# Altium schematic sheet Connectors_GPIOs_old.SchDoc
size A3
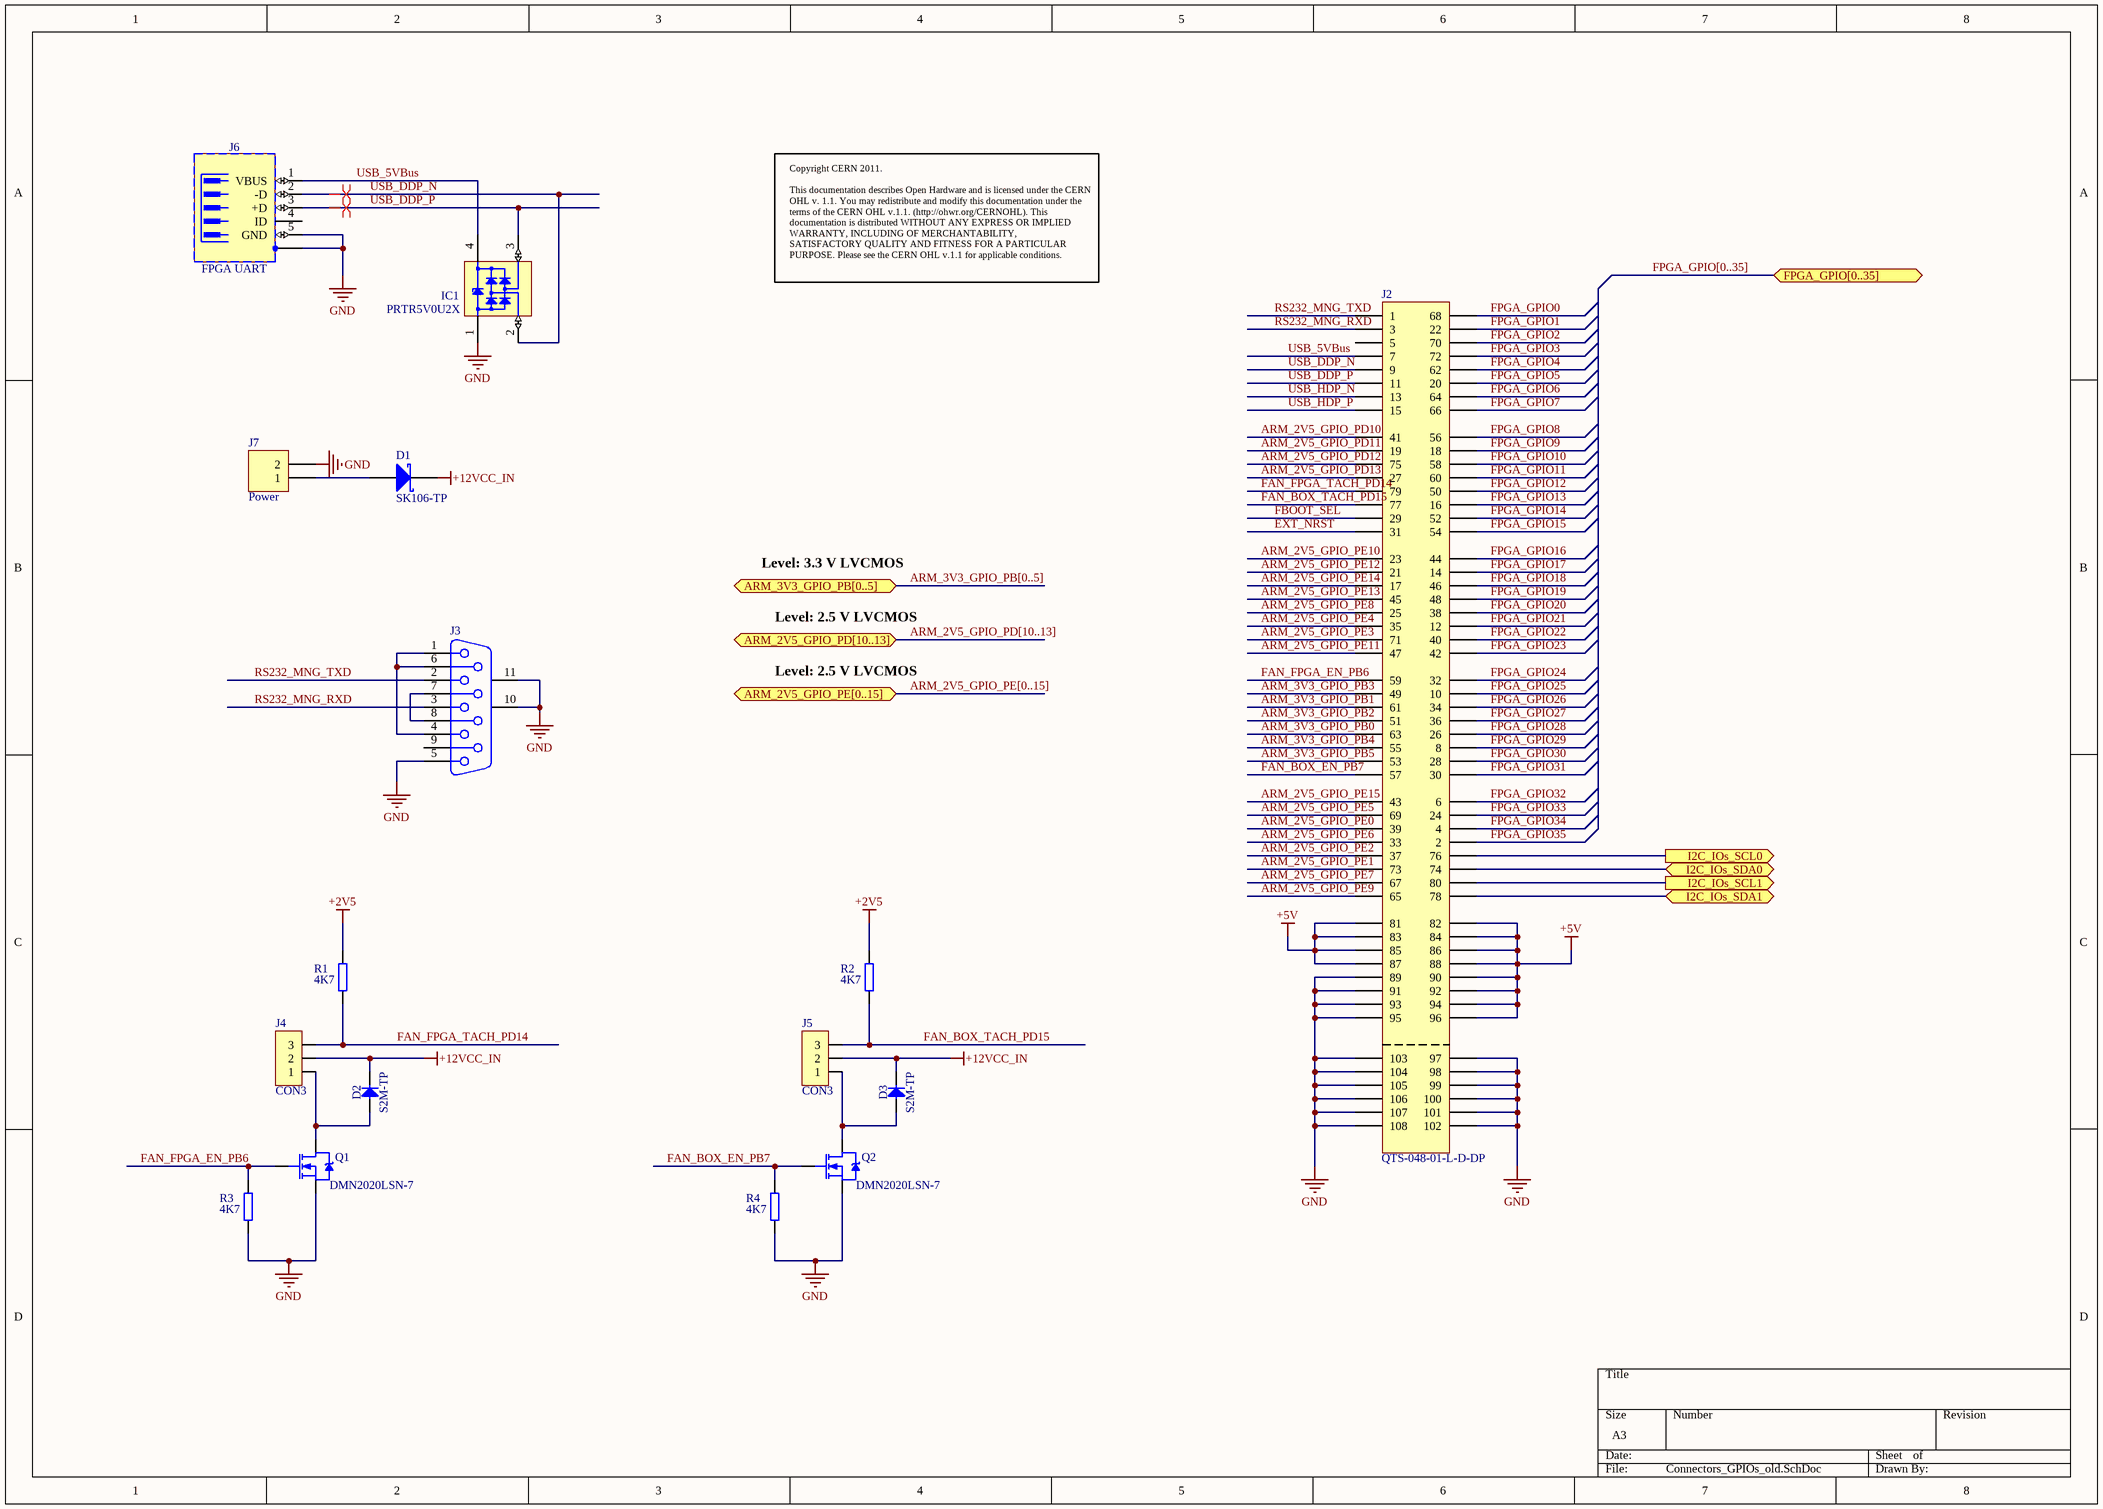
[diagram p0: Connectors_GPIOs_old.SchDoc]

## Parts
D1  SK106-TP  [DO-214AB/SMB-MCC]
D2  S2M-TP  [DO-214AA/SMB-MCC]
D3  S2M-TP  [DO-214AA/SMB-MCC]
IC1  PRTR5V0U2X  [SOT190P230X110-4N]
J2  QTS-048-01-L-D-DP  [QTS-048-XX-X-D-DP-A]
J3  D Connector 9  [DSUB1.385-2H9]  (value not drawn)
J4  CON3  [MOLEX_22-11-2032]
J5  CON3  [MOLEX_22-11-2032]
J6  FPGA UART  [TYCO_1734035-1]
J7  Power  [TYCO_794120_1]
Q1  DMN2020LSN-7  [SC-59-3]
Q2  DMN2020LSN-7  [SC-59-3]
R1  4K7  [0603]
R2  4K7  [0603]
R3  4K7  [0603]
R4  4K7  [0603]

## Ports
ARM_2V5_GPIO_PD[10..13] (bidir), ARM_2V5_GPIO_PE[0..15] (bidir), ARM_3V3_GPIO_PB[0..5] (bidir), FPGA_GPIO[0..35] (bidir), I2C_IOs_SCL0 (out), I2C_IOs_SCL1 (out), I2C_IOs_SDA0 (bidir), I2C_IOs_SDA1 (bidir)

## Nets
+2V5: R1.1 R2.1
+5V: J2.81 J2.82 J2.83 J2.84 J2.85 J2.86 J2.87 J2.88 J2.90 J2.92 J2.94 J2.96
+12VCC_IN: D1.1(K) D2.1(C) D3.1(C) J4.2 J5.2
GND: IC1.1(GND) J2.89 J2.91 J2.93 J2.95 J2.97 J2.98 J2.99 J2.100 J2.101 J2.102 J2.103 J2.104 J2.105 J2.106 J2.107 J2.108 J3.5 J3.10(MH1) J3.11(MH2) J6.5(GND) J6.6(SH) J7.2 Q1.3(S) Q2.3(S) R3.2 R4.2
ARM_2V5_GPIO_PD10: J2.41
ARM_2V5_GPIO_PD11: J2.19
ARM_2V5_GPIO_PD12: J2.75
ARM_2V5_GPIO_PD13: J2.27
ARM_2V5_GPIO_PE0: J2.39
ARM_2V5_GPIO_PE1: J2.73
ARM_2V5_GPIO_PE2: J2.37
ARM_2V5_GPIO_PE3: J2.71
ARM_2V5_GPIO_PE4: J2.35
ARM_2V5_GPIO_PE5: J2.69
ARM_2V5_GPIO_PE6: J2.33
ARM_2V5_GPIO_PE7: J2.67
ARM_2V5_GPIO_PE8: J2.25
ARM_2V5_GPIO_PE9: J2.65
ARM_2V5_GPIO_PE10: J2.23
ARM_2V5_GPIO_PE11: J2.47
ARM_2V5_GPIO_PE12: J2.21
ARM_2V5_GPIO_PE13: J2.45
ARM_2V5_GPIO_PE14: J2.17
ARM_2V5_GPIO_PE15: J2.43
ARM_3V3_GPIO_PB0: J2.63
ARM_3V3_GPIO_PB1: J2.61
ARM_3V3_GPIO_PB2: J2.51
ARM_3V3_GPIO_PB3: J2.49
ARM_3V3_GPIO_PB4: J2.55
ARM_3V3_GPIO_PB5: J2.53
EXT_NRST: J2.31
FAN_BOX_EN_PB7: J2.57 Q2.1(G) R4.1
FAN_BOX_TACH_PD15: J2.77 J5.3 R2.2
FAN_FPGA_EN_PB6: J2.59 Q1.1(G) R3.1
FAN_FPGA_TACH_PD14: J2.79 J4.3 R1.2
FBOOT_SEL: J2.29
FPGA_GPIO0: J2.68
FPGA_GPIO1: J2.22
FPGA_GPIO2: J2.70
FPGA_GPIO3: J2.72
FPGA_GPIO4: J2.62
FPGA_GPIO5: J2.20
FPGA_GPIO6: J2.64
FPGA_GPIO7: J2.66
FPGA_GPIO8: J2.56
FPGA_GPIO9: J2.18
FPGA_GPIO10: J2.58
FPGA_GPIO11: J2.60
FPGA_GPIO12: J2.50
FPGA_GPIO13: J2.16
FPGA_GPIO14: J2.52
FPGA_GPIO15: J2.54
FPGA_GPIO16: J2.44
FPGA_GPIO17: J2.14
FPGA_GPIO18: J2.46
FPGA_GPIO19: J2.48
FPGA_GPIO20: J2.38
FPGA_GPIO21: J2.12
FPGA_GPIO22: J2.40
FPGA_GPIO23: J2.42
FPGA_GPIO24: J2.32
FPGA_GPIO25: J2.10
FPGA_GPIO26: J2.34
FPGA_GPIO27: J2.36
FPGA_GPIO28: J2.26
FPGA_GPIO29: J2.8
FPGA_GPIO30: J2.28
FPGA_GPIO31: J2.30
FPGA_GPIO32: J2.6
FPGA_GPIO33: J2.24
FPGA_GPIO34: J2.4
FPGA_GPIO35: J2.2
I2C_IOs_SCL0: J2.76 ; port I2C_IOs_SCL0
I2C_IOs_SCL1: J2.80 ; port I2C_IOs_SCL1
I2C_IOs_SDA0: J2.74 ; port I2C_IOs_SDA0
I2C_IOs_SDA1: J2.78 ; port I2C_IOs_SDA1
RS232_MNG_RXD: J2.3 J3.3
RS232_MNG_TXD: J2.1 J3.2
USB_5VBus: IC1.4(VCC) J2.7 J6.1(VBUS)
USB_DDP_N: IC1.2(I/O1) J2.9 J6.2(-D)
USB_DDP_P: IC1.3(I/O2) J2.11 J6.3(+D)
USB_HDP_N: J2.13
USB_HDP_P: J2.15
NetD1_2: D1.2(A) J7.1
NetD2_2: D2.2(A) J4.1 Q1.2(D)
NetD3_2: D3.2(A) J5.1 Q2.2(D)
NetJ3_1: J3.1 J3.4 J3.6
NetJ3_7: J3.7 J3.8

Not connected (* = marked no-connect by the designer): J2 5; J3 9; J6 4(ID)

## Buses and harness runs
bus ARM_2V5_GPIO_PD[10..13] = port ARM_2V5_GPIO_PD[10..13]
bus ARM_2V5_GPIO_PE[0..15] = port ARM_2V5_GPIO_PE[0..15]
bus ARM_3V3_GPIO_PB[0..5] = port ARM_3V3_GPIO_PB[0..5]
bus FPGA_GPIO[0..35] = port FPGA_GPIO[0..35]

## Layout directives
differential pair: USB_DDP_N, USB_DDP_P

## Notes on the sheet
- Copyright CERN 2011.
  This documentation describes Open Hardware and is licensed under the CERN OHL v. 1.1. You may redistribute and modify this documentation under the terms of the CERN OHL v.1.1. (http://ohwr.org/CERNOHL). This documentation is distributed WITHOUT ANY EXPRESS OR IMPLIED WARRANTY, INCLUDING OF MERCHANTABILITY, SATISFACTORY QUALITY AND FITNESS FOR A PARTICULAR PURPOSE. Please see the CERN OHL v.1.1 for applicable conditions.
- Level: 3.3 V LVCMOS
- Level: 2.5 V LVCMOS

## Library data of the parts
D1 = SK106-TP: Schottky Diode 10A 60V; Manufacturer1: Micro Commercial Components; Distributor1 PN: SK106-TPCT-ND; Manufacturer1 PN: SK106-TP; Distributor1: Digikey
D2 D3 = S2M-TP: 2 A Silicon Rectifier 50 to 1000 Volts; Manufacturer1: Micro Commercial Components; Author: CERN DEM JLC; Manufacturer1 PN: S2M-TP; Distributor1: Digikey; Distributor1 PN: S2M-TPMSCT-ND
IC1 = PRTR5V0U2X: Ultra Low Capacitance Double Rail-to-Rail ESD Protection Diode; Part Description: Ultra Low Capacitance (1pF) Double Rail-to-Rail ESD Protection Diode (8kV); Manufacturer: PHILIPS NXP; Voltage: 5.5V; Table: Diodes; Part Number: PRTR5V0U2X; Component Kind: Standard; Component Type: Standard; Device: PRTR5V0U2X; PackageDescription: SOT143B, SOT, 1.90mm Pitch; 4 Pin, 1.30mm W X 2.90mm L X 1.10mm H body, IPC Medium Density; Manufacturer Part Number: PRTR5V0U2X; Pin Count: 4; Case: SOT143B; Mounted: Yes; Socket: No; SMD: Yes; ComponentHeight: 1.1mm; HelpURL: \\cern.ch\dfs\Applications\Altium\Datasheets\PRTR5V0U2X.pdf; Author: CERN DEM JLC; CreateDate: 3/22/2011; LatestRevisionDate: 3/22/2011
J2 = QTS-048-01-L-D-DP: High Speed Ground Plane Header; Manufacturer1: Samtec; Manufacturer1 PN: QTS-048-01-L-D-DP
J3 = D Connector 9: Receptacle Assembly, 9 Position, Right Angle; Manufacturer1 PN: 1734348-1; Manufacturer1: TE Connectivity; PackageDocument: O; Positions: 9; Published: 15-Jun-2001; LatestRevisionDate: 17-Jul-2002; LatestRevisionNote: Re-released for DXP Platform.; DatasheetDocument: 1-Sep-1999; PackageReference: 788750; Publisher: Altium Limited; Orientation: Right Angle; Gender: Receptacle; Distributor1: Digikey; Distributor1 PN: A35109-ND
J4 J5 = CON3: Connector; Manufacturer1: Molex; Distributor1: Digikey; Distributor1 PN: WM2701-ND; Manufacturer1 PN: 22-11-2032
J6 = TYCO_1734035-1: 5 Pin + 1 Shield USB Receptacle; Part Description: 5 Position, Right Angle, SMD Mini USB Type B Receptacle; Manufacturer: TYCO ELECTRONICS; Table: TYCO; Part Number: TYCO_1734035-1; Component Kind: Standard; Component Type: Standard; Pin Count: 6; Family: USB; Mounted: Yes; Socket: No; SMD: Yes; Status: None; Manufacturer Part Number: 1734035-1; ComponentHeight: 3.95mm; HelpURL: \\cern.ch\dfs\Applications\Altium\Datasheets\TYCO_1734035-1.pdf; Author: CERN DEM JLC; CreateDate: 02/05/2011; LatestRevisionDate: 02/05/2011
J7 = Header 2: Header, 2-Pin; Manufacturer1 PN: 794120-1; Manufacturer1: Tyco Electronics; LatestRevisionDate: 17-Jul-2002; LatestRevisionNote: Re-released for DXP Platform.; Publisher: Altium Limited; Distributor1: Digikey; Distributor1 PN: A25753-ND
Q1 Q2 = DMN2020LSN-7: N-Channel Power MOSFET; Manufacturer: Diodes Inc.; Published: 8-Jun-2000; LatestRevisionDate: 17-Jul-2002; LatestRevisionNote: Re-released for DXP Platform.; DatasheetVersion: PD-9.814; Publisher: Altium Limited; ComponentLink1Description: Manufacturer Link; ComponentLink1URL: http://www.irf.com/; Value: DMN2020LSN-7; Distributor1: Digikey; Distributor1 PN: DMN2020LSN-7DICT-ND
R1-R4 = R0603_4.7K_±1%_0.1W_100PPM: SMD Resistor; Manufacturer1: Panasonic; Manufacturer1 PN: ERJ-3EKF4701V; TCR: 100ppm; Power Rating: 0.1W; Tolerance: ±1%; Case: 0603; Distributor1: DigiKey; Distributor1 PN: P4.70KHCT-ND; Value: 4K7